# Altium project pulse_oximeter.PrjPCB
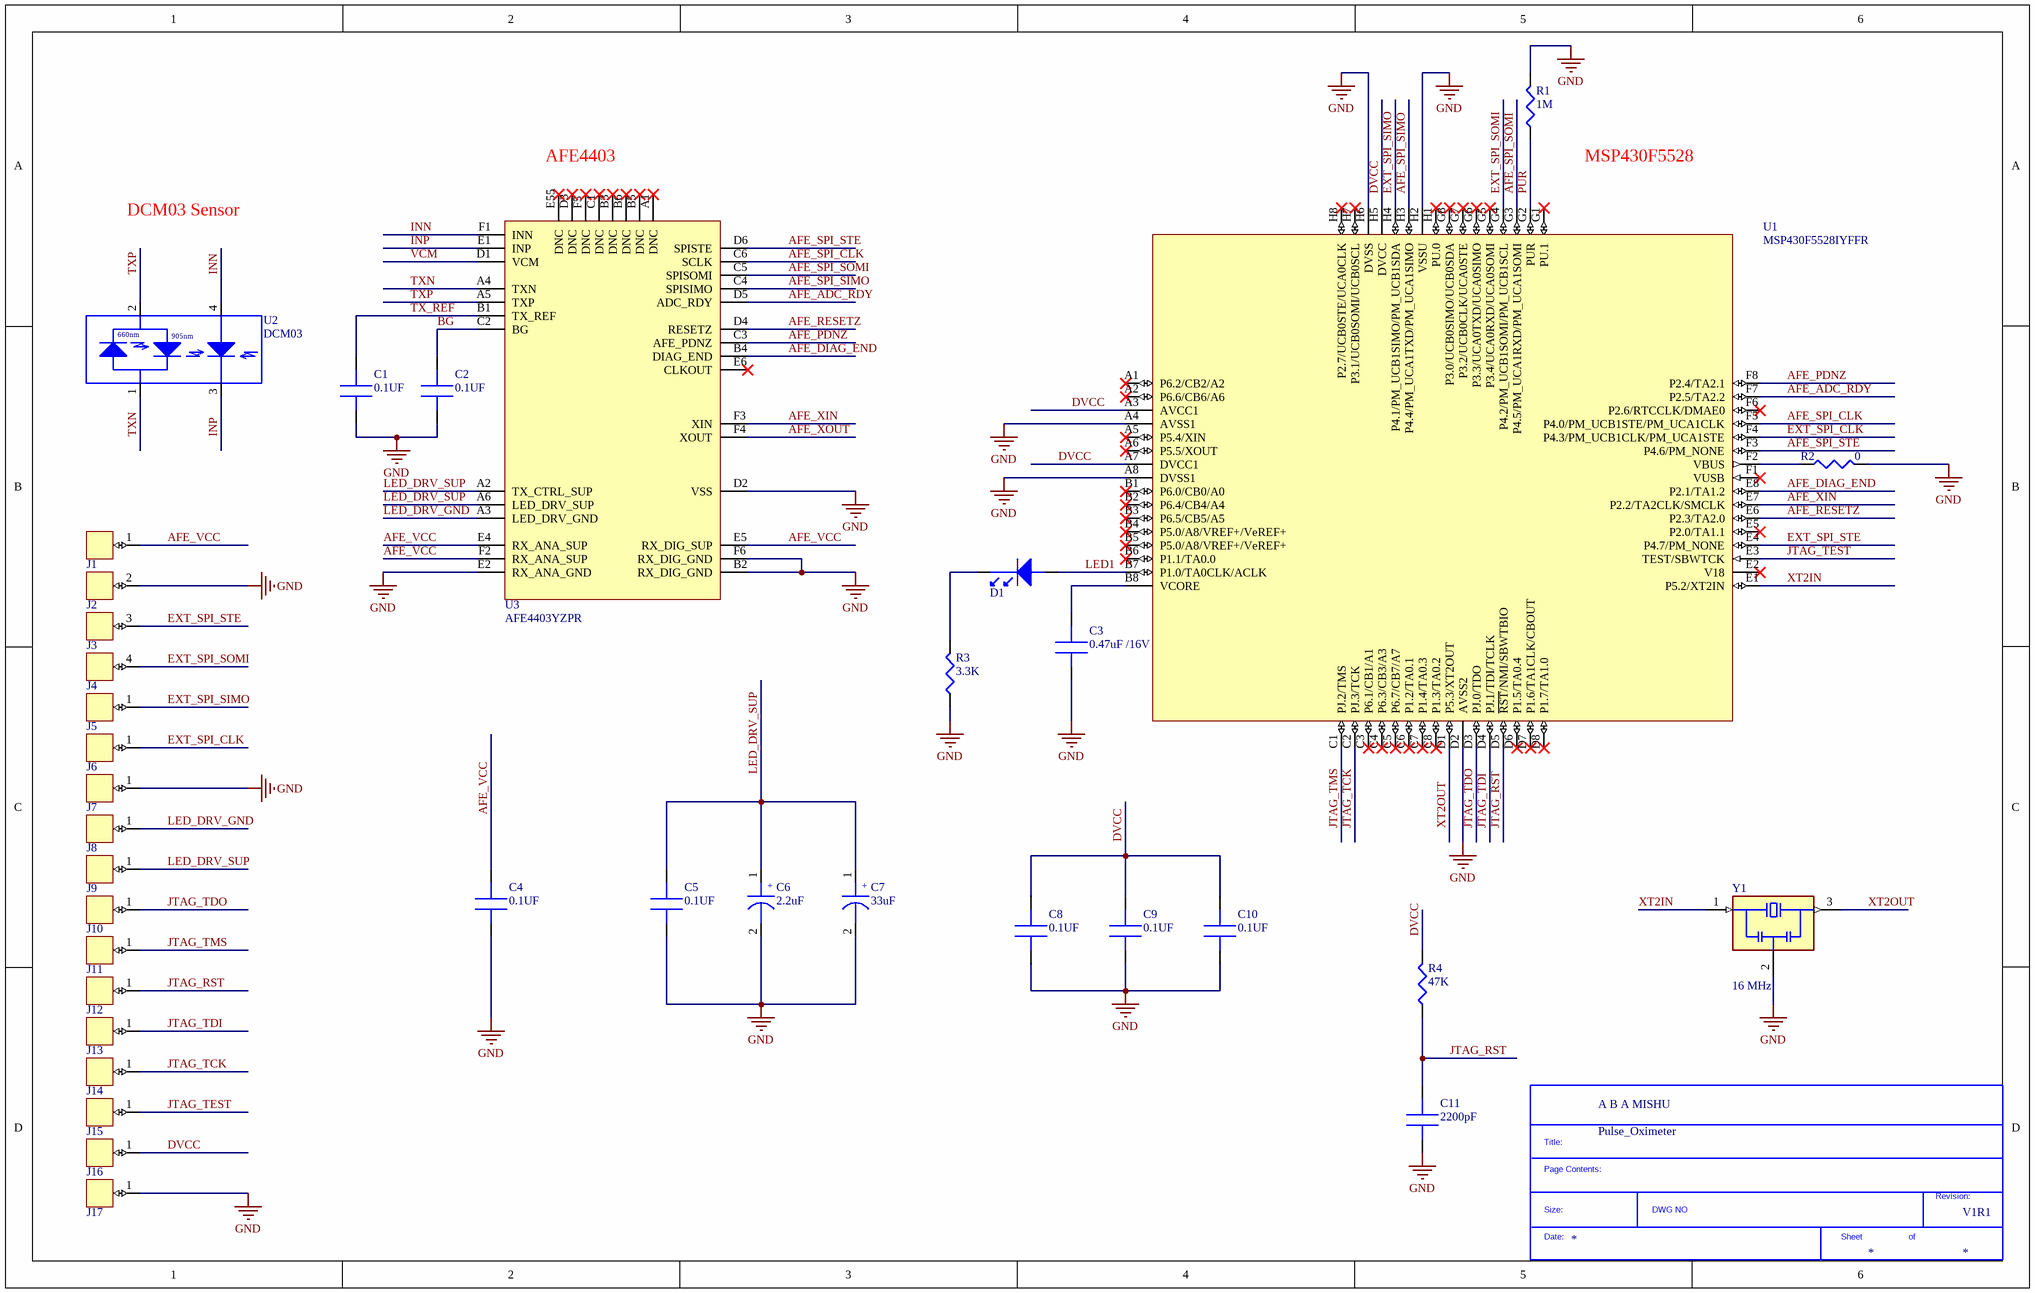
[diagram p0: pulse_oximeter.SchDoc]
Company: A B A MISHU; Project: Pulse_Oximeter; RevisioN: V1R1
1 sheet, 38 parts. Net scope: global (net labels, ports and power ports of the same name join across sheets).

## Sheet pulse_oximeter.SchDoc
size B

### Parts
*?  SDTitleBlock  (value not drawn)  (graphical)
C1  0.1UF  [C0201]
C2  0.1UF  [C0201]
C3  0.47uF /16V  [C0402]
C4  0.1UF  [C0201]
C5  0.1UF  [C0201]
C6  2.2uF  [C0603]
C7  33uF  [C0603]
C8  0.1UF  [C0201]
C9  0.1UF  [C0201]
C10  0.1UF  [C0201]
C11  2200pF  [C0201]
D1  GREEN LED  [D0402]  (value not drawn)
J1  Connector Pad  [CONECTOR PAD]  (value not drawn)
J2  Connector Pad  [CONECTOR PAD]  (value not drawn)
J3  Connector Pad  [CONECTOR PAD]  (value not drawn)
J4  Connector Pad  [CONECTOR PAD]  (value not drawn)
J5  Connector Pad  [CONECTOR PAD]  (value not drawn)
J6  Connector Pad  [CONECTOR PAD]  (value not drawn)
J7  Connector Pad  [CONECTOR PAD]  (value not drawn)
J8  Connector Pad  [CONECTOR PAD]  (value not drawn)
J9  Connector Pad  [CONECTOR PAD]  (value not drawn)
J10  Connector Pad  [CONECTOR PAD]  (value not drawn)
J11  Connector Pad  [CONECTOR PAD]  (value not drawn)
J12  Connector Pad  [CONECTOR PAD]  (value not drawn)
J13  Connector Pad  [CONECTOR PAD]  (value not drawn)
J14  Connector Pad  [CONECTOR PAD]  (value not drawn)
J15  Connector Pad  [CONECTOR PAD]  (value not drawn)
J16  Connector Pad  [CONECTOR PAD]  (value not drawn)
J17  Connector Pad  [CONECTOR PAD]  (value not drawn)
R1  1M  [R0402]
R2  0  [R0201]
R3  3.3K  [R0201]
R4  47K  [R0201]
U1  MSP430F5528IYFFR  [BGA64x8]
U2  DCM03  [DCMO3]
U3  AFE4403YZPR  [BGA36x6]
Y1  16 MHz  [RESONATOR]

### Nets
GND: C1.1 C2.1 C3.1 C4.1 C5.1 C6.2 C7.2 C8.1 C9.1 C10.1 C11.1 J2.2 J7.1 J17.1 R1.2 R2.2 R3.1 U1.A4(AVSS1) U1.A8(DVSS1) U1.D2(AVSS2) U1.H2(VSSU) U1.H6(DVSS) U3.B2(RX_DIG_GND) U3.D2(VSS) U3.E2(RX_ANA_GND) U3.F6(RX_DIG_GND) Y1.2(GND)
AFE_ADC_RDY: U1.F7(P2.5/TA2.2) U3.D5(ADC_RDY)
AFE_DIAG_END: U1.E8(P2.1/TA1.2) U3.B4(DIAG_END)
AFE_PDNZ: U1.F8(P2.4/TA2.1) U3.C3(AFE_PDNZ)
AFE_RESETZ: U1.E6(P2.3/TA2.0) U3.D4(RESETZ)
AFE_SPI_CLK: U1.F5(P4.0/PM_UCB1STE/PM_UCA1CLK) U3.C6(SCLK)
AFE_SPI_SIMO: U1.H3(P4.4/PM_UCA1TXD/PM_UCA1SIMO) U3.C4(SPISIMO)
AFE_SPI_SOMI: U1.G3(P4.5/PM_UCA1RXD/PM_UCA1SOMI) U3.C5(SPISOMI)
AFE_SPI_STE: U1.F3(P4.6/PM_NONE) U3.D6(SPISTE)
AFE_VCC: C4.2 J1.1 U3.E4(RX_ANA_SUP) U3.E5(RX_DIG_SUP) U3.F2(RX_ANA_SUP)
AFE_XIN: U1.E7(P2.2/TA2CLK/SMCLK) U3.F3(XIN)
AFE_XOUT: U3.F4(XOUT)
BG: C2.2 U3.C2(BG)
DVCC: C8.2 C9.2 C10.2 J16.1 R4.2 U1.A3(AVCC1) U1.A7(DVCC1) U1.H5(DVCC)
EXT_SPI_CLK: J6.1 U1.F4(P4.3/PM_UCB1CLK/PM_UCA1STE)
EXT_SPI_SIMO: J5.1 U1.H4(P4.1/PM_UCB1SIMO/PM_UCB1SDA)
EXT_SPI_SOMI: J4.4 U1.G4(P4.2/PM_UCB1SOMI/PM_UCB1SCL)
EXT_SPI_STE: J3.3 U1.E4(P4.7/PM_NONE)
INN: U2.4(A) U3.F1(INN)
INP: U2.3(K) U3.E1(INP)
JTAG_RST: C11.2 J12.1 R4.1 U1.D5(~{RST}/NMI/SBWTBIO)
JTAG_TCK: J14.1 U1.C2(PJ.3/TCK)
JTAG_TDI: J13.1 U1.D4(PJ.1/TDI/TCLK)
JTAG_TDO: J10.1 U1.D3(PJ.0/TDO)
JTAG_TEST: J15.1 U1.E3(TEST/SBWTCK)
JTAG_TMS: J11.1 U1.C1(PJ.2/TMS)
LED1: D1.2(Anode) U1.B7(P1.0/TA0CLK/ACLK)
LED_DRV_GND: J8.1 U3.A3(LED_DRV_GND)
LED_DRV_SUP: C5.2 C6.1 C7.1 J9.1 U3.A2(TX_CTRL_SUP) U3.A6(LED_DRV_SUP)
PUR: R1.1 U1.G2(PUR)
TX_REF: C1.2 U3.B1(TX_REF)
TXN: U2.1(A-K) U3.A4(TXN)
TXP: U2.2(A-K) U3.A5(TXP)
VCM: U3.D1(VCM)
XT2IN: U1.E1(P5.2/XT2IN) Y1.1(IN)
XT2OUT: U1.D1(P5.3/XT2OUT) Y1.3(OUT)
NetC3_2: C3.2 U1.B8(VCORE)
NetD1_1: D1.1(Cathod) R3.2
NetR2_1: R2.1 U1.F2(VBUS)

Not connected (* = marked no-connect by the designer): U1 A1(P6.2/CB2/A2)* A2(P6.6/CB6/A6)* A5(P5.4/XIN)* A6(P5.5/XOUT)* B1(P6.0/CB0/A0)* B2(P6.4/CB4/A4)* B3(P6.5/CB5/A5)* B4(P5.0/A8/VREF+/VeREF+)* B5(P5.0/A8/VREF+/VeREF+)* B6(P1.1/TA0.0)* C3(P6.1/CB1/A1)* C4(P6.3/CB3/A3)* C5(P6.7/CB7/A7)* C6(P1.2/TA0.1)* C7(P1.4/TA0.3)* C8(P1.3/TA0.2)* D6(P1.5/TA0.4)* D7(P1.6/TA1CLK/CBOUT)* D8(P1.7/TA1.0)* E2(V18)* E5(P2.0/TA1.1)* F1(VUSB)* F6(P2.6/RTCCLK/DMAE0)* G1(PU.1)* G5(P3.4/UCA0RXD/UCA0SOMI)* G6(P3.3/UCA0TXD/UCA0SIMO)* G7(P3.2/UCB0CLK/UCA0STE)* G8(P3.0/UCB0SIMO/UCB0SDA)* H1(PU.0)* H7(P3.1/UCB0SOMI/UCB0SCL)* H8(P2.7/UCB0STE/UCA0CLK)*; U3 A1(DNC)* B3(DNC)* B5(DNC)* B6(DNC)* C1(DNC)* D3(DNC)* E6(CLKOUT)* E55(DNC)* F5(DNC)*

### Notes on the sheet
- AFE4403
- MSP430F5528
- DCM03 Sensor
- (in symbol DCM03) 660nm; 905nm
- (in symbol SDTitleBlock) Title:; Page Contents:; Revision:; Size:; DWG NO; Date:; Sheet; of
- (in symbol TCM1A225M8R) +
- (in symbol TR8M336M6R3C1500) +

### Library data of the parts
C1 C2 C4 C5 C8-C10 = CL03A104KP3NNNC: CAP CER 0.1UF 10V X5R 0201; Manufacturer 1: Samsung; Capacitance: 100nF; Tolerance: 10%; Supplier 1: Digi-Key; Manufacturer Part Number 1: CL03A104KP3NNNC; Description 1: CAP CER 0.1UF 10V X5R 0201; Stock 1: 7104377; Pricing 1: 1=0.10000, 10=0.03100, 50=0.01660, 100=0.01360, 500=0.00974, 1000=0.00765, 2500=0.00696, 5000=0.00640 (USD); RoHS: Yes; Mount: Surface Mount; Case/Package: 0201; Case Code (Metric): 0603; Case Code (Imperial): 0201; Contact Plating: Tin; Min Operating Temperature: -55°C; Max Operating Temperature: 85°C; Dielectric: X5R; Packaging: Tape and Reel; Package Quantity: 1; Voltage Rating: 10V; Voltage Rating (DC): 10V; Length: 0.6mm; Width: 0.012inch; Height: 0.3mm; Thickness: 0.013inch; Depth: 0.3mm; Radiation Hardening: No; Lead Free: Lead Free; ComponentLink1URL: https://datasheet.ciiva.com/26838/getdatasheetpartid-357484-26838083.pdf?src-supplier=Verical; ComponentLink1Description: https://datasheet.ciiva.com/26838/getdatasheetpartid-357484-26838083.pdf?src-supplier=Verical; ComponentLink2URL: https://datasheet.ciiva.com/25803/cl03a104kp3nnnc-25803204.pdf?src-supplier=Digi-Key; ComponentLink2Description: https://datasheet.ciiva.com/25803/cl03a104kp3nnnc-25803204.pdf?src-supplier=Digi-Key; Supplier Part Number 1: 1276-1115-1-ND; Category: Capacitors
C3 = C1005X7S1C474K050BC: CAP CER 0.47UF 16V X7S 0402; Manufacturer 1: TDK; Capacitance: 470nF; Tolerance: 10%; Supplier 1: Digi-Key; Manufacturer Part Number 1: C1005X7S1C474K050BC; Stock 1: 4274; Pricing 1: 1=0.27000, 10=0.18200, 50=0.10880, 100=0.09200, 500=0.06292, 1000=0.05566, 2500=0.05324, 5000=0.04840 (USD); RoHS: Yes; Mount: Surface Mount; Case/Package: 0402; Case Code (Imperial): 0402; Case Code (Metric): 1005; Min Operating Temperature: -55°C; Max Operating Temperature: 125°C; Packaging: Cut Tape; Voltage Rating: 16V; RoHS Compliant: Yes; ComponentLink1URL: https://product.tdk.com/info/en/catalog/spec/mlccspec_commercial_general_midvoltage_en.pdf?src-supplier=Digi-Key; ComponentLink1Description: https://product.tdk.com/info/en/catalog/spec/mlccspec_commercial_general_midvoltage_en.pdf?src-supplier=Digi-Key; ComponentLink2URL: https://product.tdk.com/info/en/catalog/datasheets/mlcc_commercial_general_en.pdf?src-supplier=Digi-Key; ComponentLink2Description: https://product.tdk.com/info/en/catalog/datasheets/mlcc_commercial_general_en.pdf?src-supplier=Digi-Key; Supplier Part Number 1: 445-174768-1-ND; Category: Ceramic Capacitors
C6 = TCM1A225M8R: Cap Tant Solid 2.2uF 10V M CASE 20% (1.6 X 0.85 X 0.8mm) Inward L SMD 1608-08 125C T/R; Manufacturer 1: Rohm; Supplier 1: Digi-Key; Manufacturer Part Number 1: TCM1A225M8R; Stock 1: 15625; Pricing 1: 1=0.79000, 10=0.58400, 50=0.46680, 100=0.40020, 500=0.31682, 1000=0.26680 (USD); RoHS: Yes; Mount: Surface Mount; Case/Package: 0603; Case Code (Metric): 1608; Case Code (Imperial): 0603; Min Operating Temperature: -55°C; Max Operating Temperature: 125°C; Capacitance: 2.2uF; Tolerance: 20%; Package Quantity: 4000; Voltage Rating: 10V; Packaging: Tape and Reel; Voltage Rating (DC): 10V; Features: General Purpose; Series: TC; Construction: Flat; Length: 0.063inch; Width: 0.033inch; Height: 0.8mm; Height - Seated (Max): 0.035inch; Depth: 0.85mm; Lead Free: Lead Free; RoHS Compliant: Yes; ComponentLink1URL: https://datasheet.ciiva.com/258/tc-m-258332.pdf?src-supplier=Digi-Key; ComponentLink1Description: https://datasheet.ciiva.com/258/tc-m-258332.pdf?src-supplier=Digi-Key; ComponentLink2URL: https://datasheet.ciiva.com/258/tc-m-258333.pdf?src-supplier=Digi-Key; ComponentLink2Description: https://datasheet.ciiva.com/258/tc-m-258333.pdf?src-supplier=Digi-Key; ComponentLink3URL: https://datasheet.ciiva.com/258/tc-m-258334.pdf?src-supplier=Digi-Key; ComponentLink3Description: https://datasheet.ciiva.com/258/tc-m-258334.pdf?src-supplier=Digi-Key; ComponentLink4URL: https://datasheet.ciiva.com/16493/tc-m-16493454.pdf?src-supplier=Future+Electronics; ComponentLink4Description: https://datasheet.ciiva.com/16493/tc-m-16493454.pdf?src-supplier=Future+Electronics; Supplier Part Number 1: 511-1495-1-ND; Category: Tantalum Capacitors
C7 = TR8M336M6R3C1500: CAP TANT 33UF 6.3V 20% 0603; Manufacturer 1: Vishay Sprague; ESR (Equivalent Series Resistance): 1.5R; Ripple Current: 129mA; Leakage Current: 4.2uA; Dissipation Factor: 30%; Supplier 1: Digi-Key; Manufacturer Part Number 1: TR8M336M6R3C1500; Stock 1: 9416; Pricing 1: 1=2.26000, 10=1.82800, 50=1.59520, 100=1.39590, 500=1.06352, 1000=0.93058 (USD); RoHS: Yes; Mount: Surface Mount,PCB; Case/Package: 0603; Case Code (Metric): 1608; Case Code (Imperial): 0603; Weight: 7.1E-05oz; Min Operating Temperature: -55°C; Max Operating Temperature: 125°C; Package Quantity: 1; Capacitance: 33uF; Voltage Rating: 6.3V; Tolerance: 20%; Packaging: Tape and Reel; Voltage Rating (DC): 6.3V; Termination: SMD/SMT; Features: General Purpose; Series: MICROTAN® TR8; Length: 0.063inch; Width: 0.033inch; Height: 0.6mm; Height - Seated (Max): 0.035inch; Lead Free: Lead Free; RoHS Compliant: Yes; ComponentLink1URL: https://datasheet.ciiva.com/260/tr8-260774.pdf?src-supplier=Digi-Key; ComponentLink1Description: https://datasheet.ciiva.com/260/tr8-260774.pdf?src-supplier=Digi-Key; ComponentLink2URL: https://datasheet.ciiva.com/260/tr8-260775.pdf?src-supplier=Digi-Key; ComponentLink2Description: https://datasheet.ciiva.com/260/tr8-260775.pdf?src-supplier=Digi-Key; ComponentLink3URL: https://datasheet.ciiva.com/260/tr8-260776.pdf?src-supplier=Digi-Key; ComponentLink3Description: https://datasheet.ciiva.com/260/tr8-260776.pdf?src-supplier=Digi-Key; Supplier Part Number 1: 718-1672-1-ND; Category: Tantalum Capacitors
C11 = GRM033R61A222KA01D: Cap Ceramic 0.0022uF 10V X5R 10% SMD 0201 85C T/R; Manufacturer 1: Murata; Capacitance: 2.2nF; Supplier 1: Digi-Key; Manufacturer Part Number 1: GRM033R61A222KA01D; Stock 1: 295526; Pricing 1: 1=0.10000, 10=0.02200, 50=0.01180, 100=0.00960, 500=0.00684, 1000=0.00538, 2500=0.00489, 5000=0.00450 (USD); RoHS: Yes; Mount: Surface Mount; Case/Package: 0201; Number of Pins: 2; Case Code (Imperial): 0201; Case Code (Metric): 0603; Min Operating Temperature: -55°C; Max Operating Temperature: 85°C; Tolerance: 10%; Voltage Rating: 10V; Package Quantity: 1; Packaging: Tape and Reel; Dielectric: X5R; Termination: SMD/SMT; Voltage Rating (DC): 10V; Length: 0.6mm; Width: 0.012inch; Height: 0.3mm; Thickness: 0.013inch; Depth: 0.3mm; Radiation Hardening: No; REACH SVHC: No SVHC; Lead Free: Lead Free; RoHS Compliant: Yes; ComponentLink1URL: https://datasheet.ciiva.com/130/grm033r61a222ka01-01-130153.pdf?src-supplier=Digi-Key; ComponentLink1Description: https://datasheet.ciiva.com/130/grm033r61a222ka01-01-130153.pdf?src-supplier=Digi-Key; ComponentLink2URL: https://datasheet.ciiva.com/130/grm033r61a222ka01-01-130152.pdf?src-supplier=Digi-Key; ComponentLink2Description: https://datasheet.ciiva.com/130/grm033r61a222ka01-01-130152.pdf?src-supplier=Digi-Key; ComponentLink3URL: https://datasheet.ciiva.com/130/grm033r61a222ka01-01-130154.pdf?src-supplier=Digi-Key; ComponentLink3Description: https://datasheet.ciiva.com/130/grm033r61a222ka01-01-130154.pdf?src-supplier=Digi-Key; ComponentLink4URL: https://datasheet.ciiva.com/5420/product-5420355.pdf?src-supplier=Mouser; ComponentLink4Description: https://datasheet.ciiva.com/5420/product-5420355.pdf?src-supplier=Mouser; ComponentLink5URL: https://datasheet.ciiva.com/18184/getdatasheetpartid-320599-18184055.pdf?src-supplier=Verical; ComponentLink5Description: https://datasheet.ciiva.com/18184/getdatasheetpartid-320599-18184055.pdf?src-supplier=Verical; ComponentLink6URL: https://datasheet.ciiva.com/6031/482872-6031766.pdf?src-supplier=Farnell; ComponentLink6Description: https://datasheet.ciiva.com/6031/482872-6031766.pdf?src-supplier=Farnell; ComponentLink7URL: https://datasheet.ciiva.com/6031/482872-6031768.pdf?src-supplier=Farnell; ComponentLink7Description: https://datasheet.ciiva.com/6031/482872-6031768.pdf?src-supplier=Farnell; ComponentLink8URL: https://datasheet.ciiva.com/2989/product-2989275.pdf?src-supplier=Avnet; ComponentLink8Description: https://datasheet.ciiva.com/2989/product-2989275.pdf?src-supplier=Avnet; ComponentLink9URL: https://datasheet.ciiva.com/16467/product-16467343.pdf?src-supplier=Future+Electronics; ComponentLink9Description: https://datasheet.ciiva.com/16467/product-16467343.pdf?src-supplier=Future+Electronics; Supplier Part Number 1: 490-3162-1-ND; Category: Ceramic Capacitors
D1 = APHHS1005CGCK: LED GREEN CLEAR 0402 SMD; Manufacturer 1: Kingbright; Forward Current: 20mA; Forward Voltage: 2.1V; Luminous Intensity: 50mcd; Viewing Angle: 120°; Lens Style: Clear,Flat; Dominant Wavelength: 570nm; Number of LEDs: 1; Supplier 1: Digi-Key; Manufacturer Part Number 1: APHHS1005CGCK; Stock 1: 207707; Pricing 1: 1=0.39000, 10=0.25900, 100=0.17290, 500=0.11956, 1000=0.09964 (USD); RoHS: Yes; Mount: Surface Mount; Case/Package: 0402; Number of Pins: 2; Color: Green; Case Code (Metric): 1005; Case Code (Imperial): 0402; Lens Color: Clear; Min Operating Temperature: -40°C; Max Operating Temperature: 85°C; Illumination Color: Green; Packaging: Tape and Reel; Package Quantity: 2000; Test Current: 20mA; Wavelength: 570nm; Series: APHHS; Length: 1mm; Width: 0.5mm; Height: 0.6mm; Lead Free: Lead Free; RoHS Compliant: Yes; ComponentLink1URL: https://datasheet.ciiva.com/2113/aphhs1005cgck-2113972.pdf?src-supplier=Digi-Key; ComponentLink1Description: https://datasheet.ciiva.com/2113/aphhs1005cgck-2113972.pdf?src-supplier=Digi-Key; ComponentLink2URL: https://datasheet.ciiva.com/4688/aphhs1005cgck-38896-4688761.pdf?src-supplier=Mouser; ComponentLink2Description: https://datasheet.ciiva.com/4688/aphhs1005cgck-38896-4688761.pdf?src-supplier=Mouser; ComponentLink3URL: https://datasheet.ciiva.com/2113/aphhs1005cgck-2113973.pdf?src-supplier=Digi-Key; ComponentLink3Description: https://datasheet.ciiva.com/2113/aphhs1005cgck-2113973.pdf?src-supplier=Digi-Key; ComponentLink4URL: https://datasheet.ciiva.com/2113/aphhs1005cgck-2113974.pdf?src-supplier=Digi-Key; ComponentLink4Description: https://datasheet.ciiva.com/2113/aphhs1005cgck-2113974.pdf?src-supplier=Digi-Key; Supplier Part Number 1: 754-1101-1-ND; Category: LED Indication - Discrete
J1-J17 = Connector Pad: 22pin SPO2 Module Connector / pads
R1 = CRCW04021M00JNEDC: Res Thick Film 0402 1M Ohm 5% 0.063W(1/16W) ±200ppm/C Pad SMD T/R; Manufacturer 1: Vishay; Resistance: 1MR; Max Power Dissipation: 63mW; Temperature Coefficient: 200ppm/°C; Supplier 1: Digi-Key; Manufacturer Part Number 1: CRCW04021M00JNEDC; Stock 1: 137627; Pricing 1: 1=0.10000, 10=0.02300, 100=0.00950, 1000=0.00427, 2500=0.00370, 5000=0.00306 (USD); RoHS: Yes; Case/Package: 0402; Case Code (Imperial): 0402; Case Code (Metric): 1005; Min Operating Temperature: -55°C; Max Operating Temperature: 155°C; Resistor Type: Thick Film; Packaging: Tape and Reel; Tolerance: 5%; Number of Terminations: 2; RoHS Compliant: Yes; ComponentLink1URL: http://www.vishay.com/docs/28773/crcwce3.pdf?src-supplier=Digi-Key; ComponentLink1Description: http://www.vishay.com/docs/28773/crcwce3.pdf?src-supplier=Digi-Key; Supplier Part Number 1: 541-4119-1-ND; Category: Chip Resistor
R2 = ERJ-1GN0R00C: RES SMD 0 OHM JUMPER 1/20W 0201; Manufacturer 1: Panasonic; Resistance: 0R; Power Rating: 50mW; Tolerance: 1%; Voltage Rating: 25V; Temperature Coefficient: 600ppm/°C; Supplier 1: Digi-Key; Manufacturer Part Number 1: ERJ-1GN0R00C; Stock 1: 168930; Pricing 1: 1=0.10000, 10=0.02500, 25=0.01800, 50=0.01360, 100=0.01000, 250=0.00764, 500=0.00612, 1000=0.00450, 5000=0.00323 (USD); RoHS: Yes; Mount: Surface Mount; Case/Package: 0201; Case Code (Imperial): 0201; Case Code (Metric): 0603; Contact Plating: Tin; Min Operating Temperature: -55°C; Max Operating Temperature: 125°C; Packaging: Tape and Reel; Package Quantity: 15000; Resistor Type: Thick Film; Voltage Rating (DC): 25V; Features: Automotive AEC-Q200; Series: ERJ; Max Power Dissipation: 50mW; Number of Terminations: 2; Construction: Rectangular; Length: 0.6mm; Width: 0.3mm; Height: 0.23mm; Depth: 0.3mm; REACH SVHC: Unknown; Military Standard: Not; Lead Free: Lead Free; RoHS Compliant: Yes; ComponentLink1URL: https://datasheet.ciiva.com/22730/1678796-22730749.pdf?src-supplier=Element14; ComponentLink1Description: https://datasheet.ciiva.com/22730/1678796-22730749.pdf?src-supplier=Element14; Category: Chip Resistor; Supplier Part Number 1: P15979CT-ND
R3 = RC0603F332CS: RES SMD 3.3K OHM 1% 1/20W 0201; Manufacturer 1: Samsung; Resistance: 3.3kR; Max Power Dissipation: 50mW; Temperature Coefficient: 250ppm/°C; Voltage Rating (DC): 25V; Supplier 1: Digi-Key; Manufacturer Part Number 1: RC0603F332CS; Stock 1: 16670; Pricing 1: 1=0.10000, 10=0.07000, 100=0.02870, 1000=0.01288, 2500=0.01118, 5000=0.00923 (USD); RoHS: Yes; Case/Package: 0201; Case Code (Metric): 0603; Case Code (Imperial): 0201; Contact Plating: Tin; Min Operating Temperature: -55°C; Max Operating Temperature: 125°C; Packaging: Tape and Reel; Tolerance: 1%; Resistor Type: Thick Film; Number of Terminations: 2; Features: Moisture Resistant; Series: RC; Length: 0.024inch; Width: 0.012inch; Height: 0.01inch; Radiation Hardening: No; Lead Free: Lead Free; RoHS Compliant: Yes; ComponentLink1URL: https://datasheet.ciiva.com/26130/chip-resistor-150112-1-26130999.pdf?src-supplier=Digi-Key; ComponentLink1Description: https://datasheet.ciiva.com/26130/chip-resistor-150112-1-26130999.pdf?src-supplier=Digi-Key; ComponentLink2URL: https://datasheet.ciiva.com/26130/chip-resistor-150112-1-26130986.pdf?src-supplier=Digi-Key; ComponentLink2Description: https://datasheet.ciiva.com/26130/chip-resistor-150112-1-26130986.pdf?src-supplier=Digi-Key; Supplier Part Number 1: 1276-3643-1-ND; Category: Chip Resistor
R4 = RC0603F473CS: RES SMD 47K OHM 1% 1/20W 0201; Manufacturer 1: Samsung; Resistance: 47kR; Max Power Dissipation: 50mW; Temperature Coefficient: 250ppm/°C; Voltage Rating (DC): 25V; Supplier 1: Digi-Key; Manufacturer Part Number 1: RC0603F473CS; Stock 1: 3857; Pricing 1: 1=0.10000, 10=0.07000, 100=0.02870, 1000=0.01288, 2500=0.01118 (USD); RoHS: Yes; Case/Package: 0201; Case Code (Metric): 0603; Case Code (Imperial): 0201; Contact Plating: Tin; Min Operating Temperature: -55°C; Max Operating Temperature: 125°C; Packaging: Tape and Reel; Tolerance: 1%; Resistor Type: Thick Film; Number of Terminations: 2; Features: Moisture Resistant; Series: RC; Length: 0.024inch; Width: 0.012inch; Height: 0.01inch; Radiation Hardening: No; Lead Free: Lead Free; RoHS Compliant: Yes; ComponentLink1URL: https://datasheet.ciiva.com/26129/chip-resistor-150112-1-26129736.pdf?src-supplier=Digi-Key; ComponentLink1Description: https://datasheet.ciiva.com/26129/chip-resistor-150112-1-26129736.pdf?src-supplier=Digi-Key; ComponentLink2URL: https://datasheet.ciiva.com/26129/chip-resistor-150112-1-26129722.pdf?src-supplier=Digi-Key; ComponentLink2Description: https://datasheet.ciiva.com/26129/chip-resistor-150112-1-26129722.pdf?src-supplier=Digi-Key; ComponentLink3URL: https://datasheet.ciiva.com/26129/chip-resistor-150112-1-26129757.pdf?src-supplier=Digi-Key; ComponentLink3Description: https://datasheet.ciiva.com/26129/chip-resistor-150112-1-26129757.pdf?src-supplier=Digi-Key; Supplier Part Number 1: 1276-3701-1-ND; Category: Chip Resistor
U1 = MSP430F5528IYFFR: MCU 16-bit MSP430 RISC 128KB Flash 2.5V/3.3V 64-Pin DSBGA T/R; Manufacturer 1: Texas Instruments; Frequency: 25MHz; Interface: I2C,SPI,IrDA,UART,USART,LIN,SCI,USB; RAM Size: 10KB; Max Supply Voltage: 3.6V; Min Supply Voltage: 1.8V; Number of ADC Channels: 16; Number of I/Os: 47; Oscillator Type: Internal; Data Bus Width: 16b; Number of Timers/Counters: 4; Watchdog Timer: Yes; Number of UART Channels: 2; Peripherals: Brown-out Detect/Reset,POR,PWM,WDT,DMA; Core Architecture: CPUXV2; Supplier 1: Digi-Key; Manufacturer Part Number 1: MSP430F5528IYFFR; Stock 1: 0; Pricing 1: 1=9.03000, 10=8.15800, 25=7.77840, 100=6.75400, 250=6.45048, 500=5.88132, 1000=5.53350 (USD); RoHS: Yes; Case/Package: BGA; Number of Pins: 64; Min Operating Temperature: -40°C; Max Operating Temperature: 85°C; Package Quantity: 2500; Packaging: Tape and Reel; Max Frequency: 25MHz; Number of GPIO: 47; Memory Type: FLASH; Memory Size: 128KB; Number of A/D Converters: 16; Series: MSP430F5xx; Radiation Hardening: No; Lead Free: Lead Free; RoHS Compliant: Yes; ComponentLink1URL: https://datasheet.ciiva.com/1595/msp430f5528-1595689.pdf?src-supplier=Digi-Key; ComponentLink1Description: https://datasheet.ciiva.com/1595/msp430f5528-1595689.pdf?src-supplier=Digi-Key; Supplier Part Number 1: 296-36675-1-ND; Category: Microcontrollers
U2 = DCM03: Integrated Dual Emitter and / Photodetector; Manufacturer 1: APMKorea; Manufacturer Part Number 1: DCMO3
U3 = AFE4403YZPR: AFE Medical 1ADC 22-Bit 1.8V/3.3V/5V 36-Pin DSBGA T/R; Manufacturer 1: Texas Instruments; Interface: SPI; Number of Bits: 22; Number of Channels: 1; Resolution: 22b; Sampling Rate: 1.3KS/s; Min Supply Voltage: 2V; Operating Supply Voltage: 3.3V; Max Supply Voltage: 3.6V; Number of LEDs: 3; Supplier 1: Digi-Key; Manufacturer Part Number 1: AFE4403YZPR; Stock 1: 4068; Pricing 1: 1=7.94000, 10=7.17000, 25=6.83640, 100=5.93590, 250=5.66908, 500=5.50550 (USD); RoHS: Yes; Mount: Surface Mount; Number of Pins: 36; Contact Plating: Copper,Tin,Silver; Min Operating Temperature: -20°C; Max Operating Temperature: 70°C; Packaging: Tape and Reel; Number of A/D Converters: 1; Max Input Voltage: 3.6V; Number of Inputs: 1; Type: General Purpose; Lead Free: Lead Free; RoHS Compliant: Yes; ComponentLink1URL: http://components.arrow.com/part/dataview/66454193S898280N7713?src-supplier=Arrow+Electronics; ComponentLink1Description: http://components.arrow.com/part/dataview/66454193S898280N7713?src-supplier=Arrow+Electronics; ComponentLink2URL: http://www.ti.com/lit/gpn/afe4403?src-supplier=Mouser; ComponentLink2Description: http://www.ti.com/lit/gpn/afe4403?src-supplier=Mouser; ComponentLink3URL: http://www.ti.com/general/docs/suppproductinfo.tsp?distId=10&amp;gotoUrl=http%3A%2F%2Fwww.ti.com%2Flit%2Fgpn%2Fafe4403&src-supplier=Digi-Key; ComponentLink3Description: http://www.ti.com/general/docs/suppproductinfo.tsp?distId=10&amp;gotoUrl=http%3A%2F%2Fwww.ti.com%2Flit%2Fgpn%2Fafe4403&src-supplier=Digi-Key; ComponentLink4URL: http://www.ti.com/lit/ds/symlink/afe4403.pdf?src-supplier=Digi-Key; ComponentLink4Description: http://www.ti.com/lit/ds/symlink/afe4403.pdf?src-supplier=Digi-Key; ComponentLink5URL: http://www.ti.com/general/docs/lit/getliterature.tsp?genericPartNumber=AFE4403&&fileType=pdf&src-supplier=Avnet; ComponentLink5Description: http://www.ti.com/general/docs/lit/getliterature.tsp?genericPartNumber=AFE4403&&fileType=pdf&src-supplier=Avnet; ComponentLink6URL: http://www.ti.com/general/docs/lit/getliterature.tsp?genericPartNumber=AFE4403&amp;&amp;fileType=pdf&src-supplier=Avnet+Asia; ComponentLink6Description: http://www.ti.com/general/docs/lit/getliterature.tsp?genericPartNumber=AFE4403&amp;&amp;fileType=pdf&src-supplier=Avnet+Asia; Supplier Part Number 1: 296-46409-1-ND; Category: Integrated Circuits
Y1 = CSTCE16M0V53-R0: Ceramic Resonator 16MHz ±0.5% (Tol) ±0.3% (Stability) 15pF 40Ohm 3-Pin CSMD T/R; Manufacturer 1: Murata; Impedance: 40R; Frequency Stability: 0.2%; Supplier 1: Digi-Key; Manufacturer Part Number 1: CSTCE16M0V53-R0; Stock 1: 0; RoHS: Yes; Case/Package: SMD/SMT; Number of Pins: 3; Contact Plating: Gold; Weight: 0.001023oz; Min Operating Temperature: -20°C; Max Operating Temperature: 80°C; Frequency: 16MHz; Frequency Tolerance: 0.5%; Self Resonant Frequency: 16MHz; Load Capacitance: 15pF; Tolerance: 0.5%; Package Quantity: 3000; Capacitance: 15pF; Packaging: Tape and Reel; Termination: SMD/SMT; Resistor Type: Ceramic; Series: CSTCE_V; Length: 3.2mm; Width: 1.3mm; Height: 0.9mm; REACH SVHC: No SVHC; Lead Free: Lead Free; RoHS Compliant: Yes; ComponentLink1URL: https://datasheet.ciiva.com/18183/getdatasheetpartid-152969-18183272.pdf?src-supplier=Verical; ComponentLink1Description: https://datasheet.ciiva.com/18183/getdatasheetpartid-152969-18183272.pdf?src-supplier=Verical; ComponentLink2URL: https://datasheet.ciiva.com/884/p16e-884477.pdf?src-supplier=Digi-Key; ComponentLink2Description: https://datasheet.ciiva.com/884/p16e-884477.pdf?src-supplier=Digi-Key; ComponentLink3URL: https://datasheet.ciiva.com/1361/1506176-1361293.pdf?src-supplier=Element14; ComponentLink3Description: https://datasheet.ciiva.com/1361/1506176-1361293.pdf?src-supplier=Element14; ComponentLink4URL: https://datasheet.ciiva.com/884/p16e-884478.pdf?src-supplier=Digi-Key; ComponentLink4Description: https://datasheet.ciiva.com/884/p16e-884478.pdf?src-supplier=Digi-Key; ComponentLink5URL: https://datasheet.ciiva.com/884/p16e-884479.pdf?src-supplier=Digi-Key; ComponentLink5Description: https://datasheet.ciiva.com/884/p16e-884479.pdf?src-supplier=Digi-Key; ComponentLink6URL: https://datasheet.ciiva.com/14132/ceralock-eng-bro-14132735.pdf?src-supplier=Distrelec; ComponentLink6Description: https://datasheet.ciiva.com/14132/ceralock-eng-bro-14132735.pdf?src-supplier=Distrelec; ComponentLink7URL: https://datasheet.ciiva.com/16216/l0430e-16216847.pdf?src-supplier=Future+Electronics; ComponentLink7Description: https://datasheet.ciiva.com/16216/l0430e-16216847.pdf?src-supplier=Future+Electronics; Supplier Part Number 1: 490-1198-1-ND; Category: Resonator